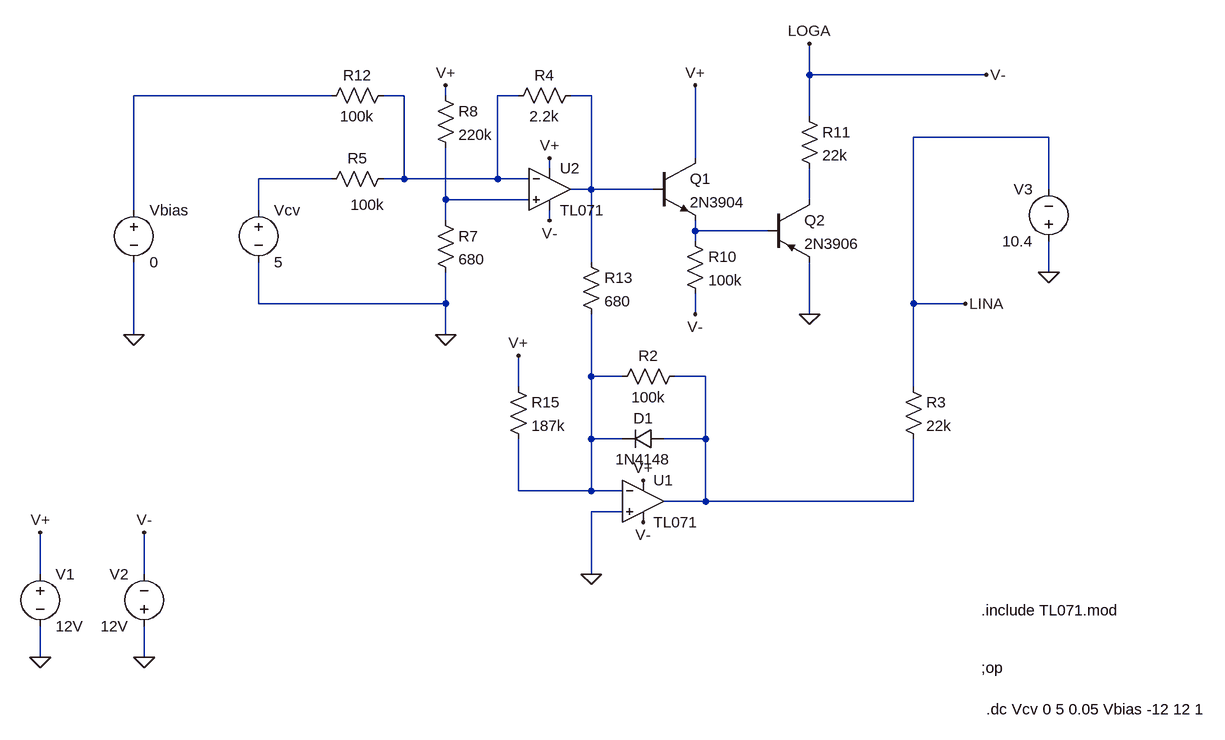
[diagram p0: schematic VCA-13700.asc]
VCA-13700.asc, the LTspice schematic file:
Version 4
SHEET 1 1144 1588
WIRE 320 -144 320 -192
WIRE 592 -144 320 -144
WIRE -416 -112 -720 -112
WIRE -304 -112 -336 -112
WIRE -240 -112 -240 -128
WIRE -128 -112 -160 -112
WIRE -16 -112 -48 -112
WIRE 320 -80 320 -144
WIRE 688 -48 480 -48
WIRE 144 -16 144 -128
WIRE -80 0 -80 -16
WIRE -416 16 -528 16
WIRE -304 16 -304 -112
WIRE -304 16 -336 16
WIRE -160 16 -160 -112
WIRE -160 16 -304 16
WIRE -112 16 -160 16
WIRE -16 32 -16 -112
WIRE -16 32 -48 32
WIRE 80 32 -16 32
WIRE 688 32 688 -48
WIRE -240 48 -240 -32
WIRE -112 48 -240 48
WIRE 320 48 320 0
WIRE -720 64 -720 -112
WIRE -528 64 -528 16
WIRE -240 80 -240 48
WIRE -80 80 -80 64
WIRE 144 96 144 80
WIRE 256 96 144 96
WIRE 144 112 144 96
WIRE -16 144 -16 32
WIRE 688 160 688 112
WIRE -528 208 -528 144
WIRE -240 208 -240 160
WIRE -240 208 -528 208
WIRE 480 208 480 -48
WIRE 560 208 480 208
WIRE 144 224 144 192
WIRE 320 224 320 144
WIRE -720 256 -720 144
WIRE -240 256 -240 208
WIRE -16 320 -16 224
WIRE 32 320 -16 320
WIRE 160 320 112 320
WIRE -128 336 -128 288
WIRE 480 336 480 208
WIRE -16 416 -16 320
WIRE 32 416 -16 416
WIRE 160 416 160 320
WIRE 160 416 96 416
WIRE -128 496 -128 416
WIRE -16 496 -16 416
WIRE -16 496 -128 496
WIRE 32 496 -16 496
WIRE 160 512 160 416
WIRE 160 512 96 512
WIRE 480 512 480 416
WIRE 480 512 160 512
WIRE 32 528 -16 528
WIRE -864 624 -864 560
WIRE -704 624 -704 560
WIRE -16 624 -16 528
WIRE -864 752 -864 704
WIRE -704 752 -704 704
FLAG -240 256 0
FLAG -864 752 0
FLAG -704 752 0
FLAG -864 560 V+
FLAG -80 -16 V+
FLAG 64 480 V+
FLAG -704 560 V-
FLAG -80 80 V-
FLAG 64 544 V-
FLAG -240 -128 V+
FLAG 144 -128 V+
FLAG 144 224 V-
FLAG 320 224 0
FLAG 320 -192 LOGA
FLAG 592 -144 V-
FLAG -720 256 0
FLAG 560 208 LINA
FLAG -16 624 0
FLAG -128 288 V+
FLAG 688 160 0
DATAFLAG 32 32 ""
SYMBOL Opamps\\opamp2 64 448 R0
SYMATTR InstName U1
SYMATTR Value TL071
SYMBOL voltage -864 608 R0
SYMATTR InstName V1
SYMATTR Value 12V
SYMBOL voltage -704 720 R180
WINDOW 0 24 96 Left 2
WINDOW 3 24 16 Left 2
SYMATTR InstName V2
SYMATTR Value 12V
SYMBOL res 128 304 R90
WINDOW 0 0 56 VBottom 2
WINDOW 3 32 56 VTop 2
SYMATTR InstName R2
SYMATTR Value 100k
SYMBOL res 464 320 R0
SYMATTR InstName R3
SYMATTR Value 22k
SYMBOL Opamps\\opamp2 -80 -32 R0
SYMATTR InstName U2
SYMATTR Value TL071
SYMBOL res -32 -128 R90
WINDOW 0 0 56 VBottom 2
WINDOW 3 32 56 VTop 2
SYMATTR InstName R4
SYMATTR Value 2.2k
SYMBOL res -320 0 R90
WINDOW 0 0 56 VBottom 2
WINDOW 3 40 40 VTop 2
SYMATTR InstName R5
SYMATTR Value 100k
SYMBOL voltage -528 48 R0
WINDOW 123 0 0 Left 2
WINDOW 39 0 0 Left 2
SYMATTR InstName Vcv
SYMATTR Value 5
SYMBOL res -256 64 R0
SYMATTR InstName R7
SYMATTR Value 680
SYMBOL res -256 -128 R0
SYMATTR InstName R8
SYMATTR Value 220k
SYMBOL npn 80 -16 R0
SYMATTR InstName Q1
SYMATTR Value 2N3904
SYMBOL res 128 96 R0
SYMATTR InstName R10
SYMATTR Value 100k
SYMBOL pnp 256 48 R0
SYMATTR InstName Q2
SYMATTR Value 2N3906
SYMBOL res 304 -96 R0
SYMATTR InstName R11
SYMATTR Value 22k
SYMBOL res -320 -128 R90
WINDOW 0 0 56 VBottom 2
WINDOW 3 32 56 VTop 2
SYMATTR InstName R12
SYMATTR Value 100k
SYMBOL voltage -720 48 R0
SYMATTR InstName Vbias
SYMATTR Value 0
SYMBOL res -32 128 R0
SYMATTR InstName R13
SYMATTR Value 680
SYMBOL res -144 320 R0
SYMATTR InstName R15
SYMATTR Value 187k
SYMBOL diode 96 400 R90
WINDOW 0 0 32 VBottom 2
WINDOW 3 32 32 VTop 2
SYMATTR InstName D1
SYMATTR Value 1N4148
SYMBOL voltage 688 128 R180
WINDOW 0 24 96 Left 2
WINDOW 3 24 16 Left 2
SYMATTR InstName V3
SYMATTR Value 10.4
TEXT 584 680 Left 2 !.include TL071.mod
TEXT 584 768 Left 2 !;op
TEXT 592 832 Left 2 !.dc Vcv 0 5 0.05 Vbias -12 12 1

The netlist it stands for:
* VCA-13700.asc
XU1 0 N008 V+ LOGA N009 TL071  ; pins In+ In- V+ V- OUT
V1 V+ 0 12V
V2 0 LOGA 12V
R2 N009 N008 100k
R3 LINA N009 22k
XU2 N005 N002 V+ LOGA N003 TL071  ; pins In+ In- V+ V- OUT
R4 N003 N002 2.2k
R5 N002 N004 100k
Vcv N004 0 5
R7 N005 0 680
R8 V+ N005 220k
Q1 V+ N003 N007 0 2N3904
R10 N007 LOGA 100k
Q2 N006 N007 0 0 2N3906
R11 LOGA N006 22k
R12 N002 N001 100k
Vbias N001 0 0
R13 N003 N008 680
R15 V+ N008 187k
D1 N009 N008 1N4148
V3 0 LINA 10.4
.model D D
.lib standard.dio
.model NPN NPN
.model PNP PNP
.lib standard.bjt
.include TL071.mod
;op
.dc Vcv 0 5 0.05 Vbias -12 12 1
.backanno
.end